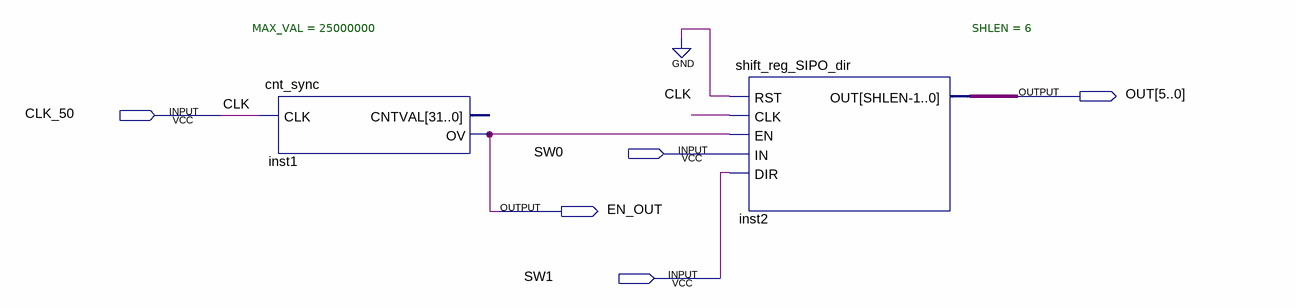
[diagram p0: schematic sheet]
// Quartus schematic start_5.bdf as structural Verilog: 2 symbols, 5 pins
module start_5 (
  input  CLK_50,
  input  SW0,
  input  SW1,
  output [5:0] OUT,
  output EN_OUT
);

  cnt_sync #(.MAX_VAL(25000000)) inst1 (.CLK(CLK_50), .OV(EN_OUT));  // open: CNTVAL
  shift_reg_SIPO_dir #(.SHLEN(6)) inst2 (.RST(1'b0), .CLK(CLK_50), .EN(EN_OUT), .IN(SW0), .DIR(SW1), .OUT(OUT));

  // Other names for the same wires on the sheet: CLK = CLK_50
endmodule
